# Altium schematic sheet Sheet4.SchDoc
size A3
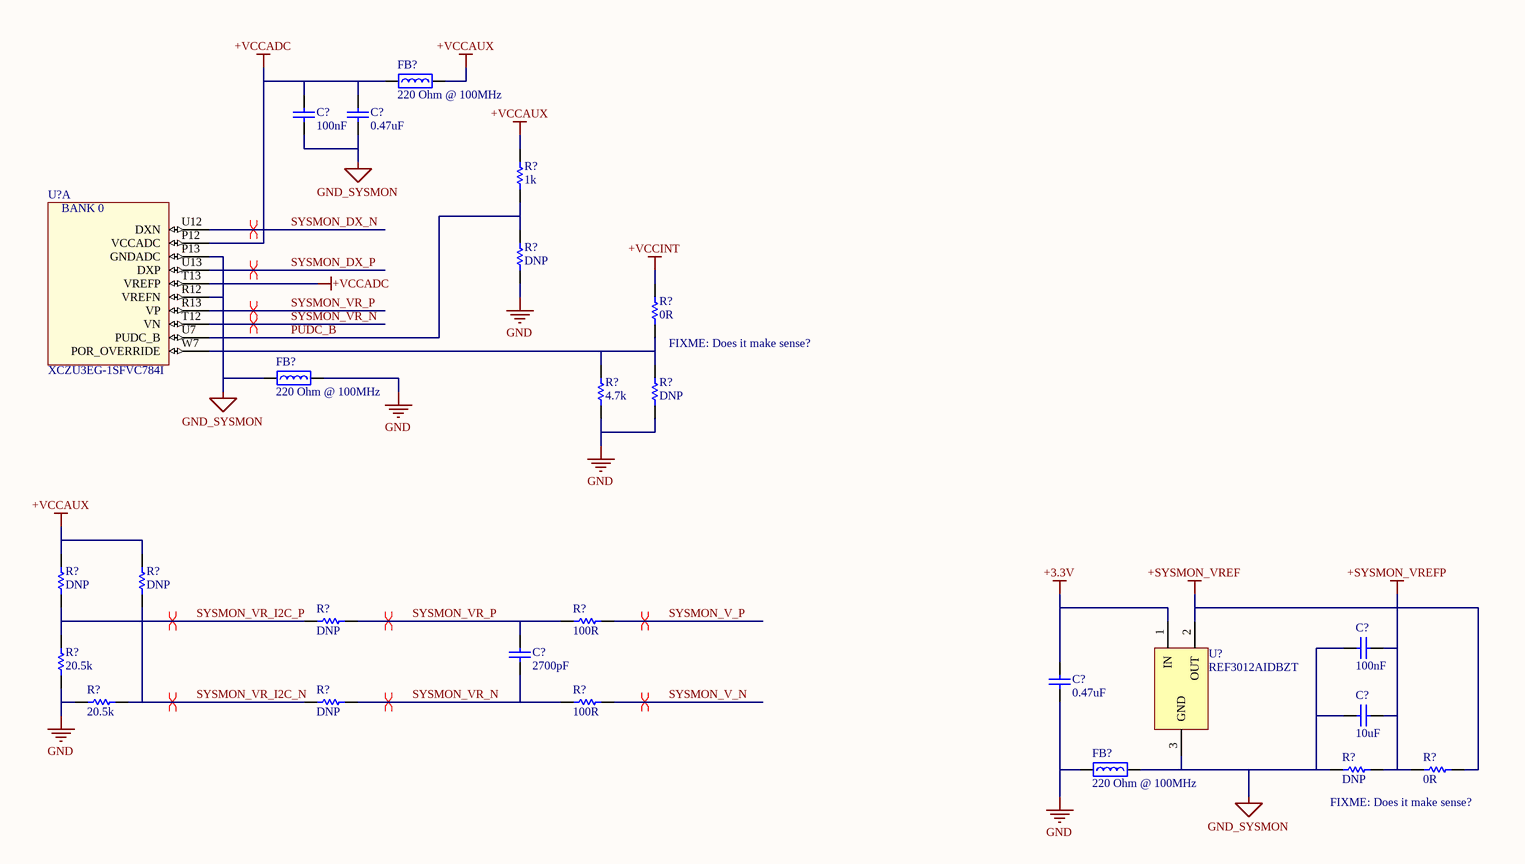
[diagram p0: Sheet4.SchDoc]

## Parts
(Parts that share a designator on the sheet are numbered #1, #2 ... from top to bottom, then left to right.)
C?#1  100nF  [CAPC1005L_0402]
C?#2  0.47uF  [CAPC1005L_0402]
C?#3  2700pF  [CAPC1005L_0402]
C?#4  100nF  [CAPC1005L_0402]
C?#5  0.47uF  [CAPC1005L_0402]
C?#6  10uF  [CAPC1005L_0402]
FB?#1  Impedance @ Frequency: 220 Ohm @ 100MHz  [INDC1608N_0603]  (hidden comment: BEAD0603_220_2A5_40M)
FB?#2  Impedance @ Frequency: 220 Ohm @ 100MHz  [INDC1608N_0603]  (hidden comment: BEAD0603_220_2A5_40M)
FB?#3  Impedance @ Frequency: 220 Ohm @ 100MHz  [INDC1608N_0603]  (hidden comment: BEAD0603_220_2A5_40M)
R?#1  value 1k  [RESC1005L_0402]  (hidden comment: RES0402_1K_0W1_1T)
R?#2  value DNP  [RESC1005L_0402]  (hidden comment: RES0402)
R?#3  value 0R  [RESC1005L_0402]  (hidden comment: RES0402_0R_0W1)
R?#4  value 4.7k  [RESC1005L_0402]  (hidden comment: RES0402_4K7_0W1_1T)
R?#5  value DNP  [RESC1005L_0402]  (hidden comment: RES0402)
R?#6  value DNP  [RESC1005L_0402]  (hidden comment: RES0402)
R?#7  value DNP  [RESC1005L_0402]  (hidden comment: RES0402)
R?#8  value DNP  [RESC1005L_0402]  (hidden comment: RES0402)
R?#9  value 100R  [RESC1005L_0402]  (hidden comment: RES0402_100R_0W1_1T)
R?#10  value 20.5k  [RESC1005L_0402]  (hidden comment: RES0402_20K5_0W1_1T)
R?#11  value 20.5k  [RESC1005L_0402]  (hidden comment: RES0402_20K5_0W1_1T)
R?#12  value DNP  [RESC1005L_0402]  (hidden comment: RES0402)
R?#13  value 100R  [RESC1005L_0402]  (hidden comment: RES0402_100R_0W1_1T)
R?#14  value DNP  [RESC1005L_0402]  (hidden comment: RES0402)
R?#15  value 0R  [RESC1005L_0402]  (hidden comment: RES0402_0R_0W1)
U?#1  XCZU3EG-1SFVC784I  [BGA784x28]  (part A of 22)
U?#2  REF3012AIDBZT  [TI-DBZ3_N]

## Nets
+3.3V: C?#5.1 U?#2.1(IN)
+SYSMON_VREF: R?#15.1 U?#2.2(OUT)
+SYSMON_VREFP: C?#4.1 C?#6.2 R?#14.1 R?#15.2
+VCCADC: C?#1.1 C?#2.1 FB?#1.1 U?#1.P12(VCCADC) U?#1.T13(VREFP)
+VCCAUX: FB?#1.2 R?#1.1 R?#6.1 R?#7.1
+VCCINT: R?#3.1
GND: C?#5.2 FB?#2.2 FB?#3.1 R?#2.2 R?#4.2 R?#5.2 R?#10.2 R?#11.2
GND_SYSMON: C?#1.2 C?#2.2 C?#4.2 C?#6.1 FB?#2.1 FB?#3.2 R?#14.2 U?#1.P13(GNDADC) U?#1.R12(VREFN) U?#2.3(GND)
PUDC_B: R?#1.2 R?#2.1 U?#1.U7(PUDC_B)
SYSMON_DX_N: U?#1.U12(DXN)
SYSMON_DX_P: U?#1.U13(DXP)
SYSMON_V_N: R?#13.2
SYSMON_V_P: R?#9.2
SYSMON_VR_I2C_N: R?#7.2 R?#11.1 R?#12.2
SYSMON_VR_I2C_P: R?#6.2 R?#8.2 R?#10.1
SYSMON_VR_N: C?#3.2 R?#12.1 R?#13.1 U?#1.T12(VN)
SYSMON_VR_P: C?#3.1 R?#8.1 R?#9.1 U?#1.R13(VP)
NetR?#3_2: R?#3.2 R?#4.1 R?#5.1 U?#1.W7(POR_OVERRIDE)

## Layout directives
differential pair: SYSMON_DX_N, SYSMON_DX_P, SYSMON_V_N, SYSMON_V_P, SYSMON_VR_I2C_N, SYSMON_VR_I2C_P, SYSMON_VR_N, SYSMON_VR_P

## Notes on the sheet
- (near R?#3) FIXME: Does it make sense?
- (near R?#14) FIXME: Does it make sense?
- (in symbol XCZU3EG-1SFVC784I, part A) BANK 0

## Library data of the parts
C?#1 C?#4 = CAPCER0402X7R100N25V_10T: CAP CER 0.1UF 25V X7R 0402; Manufacturer 1: Murata Electronics North America; Manufacturer Part Number 1: GRM155R71E104KE14D; Tolerance: 10%; Package: 0402; ComponentLink1Description: Datasheet; Value: 100nF; Voltage: 25V; Temperature Coefficient: X7R; Supplier 1: Digi-Key; Supplier Part Number 1: 490-10698-1-ND; Operating Temperature: -55°C ~ 125°C
C?#2 C?#5 = CAPCER0402X5R0U4710V_10T: CAP CER 0.47UF 10V X5R 0402; Manufacturer 1: Murata Electronics North America; Manufacturer Part Number 1: GRM155R61A474KE15D; Tolerance: 10%; Package: 0402; ComponentLink1Description: Datasheet; Value: 0.47uF; Voltage: 10V; Temperature Coefficient: X5R; Supplier 1: Digi-Key; Supplier Part Number 1: 490-3264-1-ND; Operating Temperature: -55°C ~ 85°C
C?#3 = CAPCER0402X7R2700P50V_10T: CAP CER 2700PF 50V X7R 0402; Manufacturer 1: Murata Electronics North America; Manufacturer Part Number 1: GRM155R71H272KA01D; Tolerance: 10%; Package: 0402; ComponentLink1Description: Datasheet; Value: 2700pF; Voltage: 50V; Temperature Coefficient: X7R; Supplier 1: Digi-Key; Supplier Part Number 1: 490-1306-1-ND; Operating Temperature: -55°C ~ 125°C
C?#6 = CAPCER0402X5R10U10V_20T: CAP CER 10UF 10V X5R 0402; Manufacturer 1: Samsung Electro-Mechanics America, Inc.; Manufacturer Part Number 1: CL05A106MP5NUNC; Tolerance: 20%; Package: 0402; ComponentLink1Description: Datasheet; Value: 10uF; Voltage: 10V; Temperature Coefficient: X5R; Supplier 1: Digi-Key; Supplier Part Number 1: 1276-1450-1-ND; Operating Temperature: -55°C ~ 85°C
FB?#1-FB?#3 = BEAD0603_220_2A5_40M: FERRITE BEAD 220 OHM 0603 1LN; Manufacturer 1: Murata Electronics North America; Manufacturer Part Number 1: BLM18SG221TN1D; Current Rating (Max): 2.5A; DC Resistance (DCR) (Max): 40 mohm; Package: 0603; ComponentLink1Description: Datasheet; ComponentLink1URL: C:\Users\Public\Documents\Altium\AD16\Library\PDF\ENFA0003.pdf; Supplier 1: Digi-Key; Supplier Part Number 1: 490-5225-1-ND; Operating Temperature: -55°C ~ 125°C
R?#1 = RES0402_1K_0W1_1T: RES SMD 1K OHM 1% 1/10W 0402; Manufacturer 1: Panasonic Electronic Components; Manufacturer Part Number 1: ERJ-2RKF1001X; Package: 0402; ComponentLink1Description: Datasheet; Power: 1/10W; Tolerance: 1%; Supplier 1: Digi-Key; Supplier Part Number 1: P1.00KLCT-ND
R?#2 R?#5-R?#8 R?#12 R?#14 = RES0402: RES SMD 0402 Footprint; Package: 0402; ComponentLink1Description: Datasheet; Tolerance: -
R?#3 R?#15 = RES0402_0R_0W1: RES SMD 0 OHM JUMPER 1/10W 0402; Manufacturer 1: Panasonic Electronic Components; Manufacturer Part Number 1: ERJ-2GE0R00X; Package: 0402; ComponentLink1Description: Datasheet; Power: 1/10W; Tolerance: -; Supplier 1: Digi-Key; Supplier Part Number 1: P0.0JCT-ND
R?#4 = RES0402_4K7_0W1_1T: RES SMD 4.7K OHM 1% 1/10W 0402; Manufacturer 1: Panasonic Electronic Components; Manufacturer Part Number 1: ERJ-2RKF4701X; Package: 0402; ComponentLink1Description: Datasheet; Power: 1/10W; Tolerance: 1%; Supplier 1: Digi-Key; Supplier Part Number 1: P4.70KLCT-ND
R?#9 R?#13 = RES0402_100R_0W1_1T: RES SMD 100 OHM 1% 1/10W 0402; Manufacturer 1: Panasonic Electronic Components; Manufacturer Part Number 1: ERJ-2RKF1000X; Package: 0402; ComponentLink1Description: Datasheet; Power: 1/10W; Tolerance: 1%; Supplier 1: Digi-Key; Supplier Part Number 1: P100LCT-ND
R?#10 R?#11 = RES0402_20K5_0W1_1T: RES SMD 20.5K OHM 1% 1/10W 0402; Manufacturer 1: Panasonic Electronic Components; Manufacturer Part Number 1: ERJ-2RKF2052X; Package: 0402; ComponentLink1Description: Datasheet; Power: 1/10W; Tolerance: 1%; Supplier 1: Digi-Key; Supplier Part Number 1: P20.5KLCT-ND
U?#1 = XCZU3EG-1SFVC784I: IC FPGA 252 I/O 784FCBGA - XILINX ZYNQ ULTRASCALE+; Manufacturer 1: Xilinx Inc.; Package: SFVC784; ComponentLink1Description: Datasheet; Supplier 1: Digi-Key; Supplier Part Number 1: XCZU3EG-1SFVC784I-ND; Manufacturer Part Number 1: XCZU3EG-1SFVC784I
U?#2 = REF3012AIDBZT: IC VREF SERIES 1.25V SOT23-3; Manufacturer 1: Texas Instruments; Voltage - Input: 1.8 V ~ 5.5 V; ComponentLink1Description: Datasheet; ComponentLink1URL: C:\Users\Public\Documents\Altium\AD16\Library\PDF\ref3012.pdf; Supplier 1: Digi-Key; Supplier Part Number 1: REF3012AIDBZTCT-ND; Manufacturer Part Number 1: REF3012AIDBZT; Operating Temperature: -40°C ~ 125°C (TA); Voltage - Output (Min/Fixed): 1.25V